# EAGLE schematic untitled (EAGLE 9.4.0)
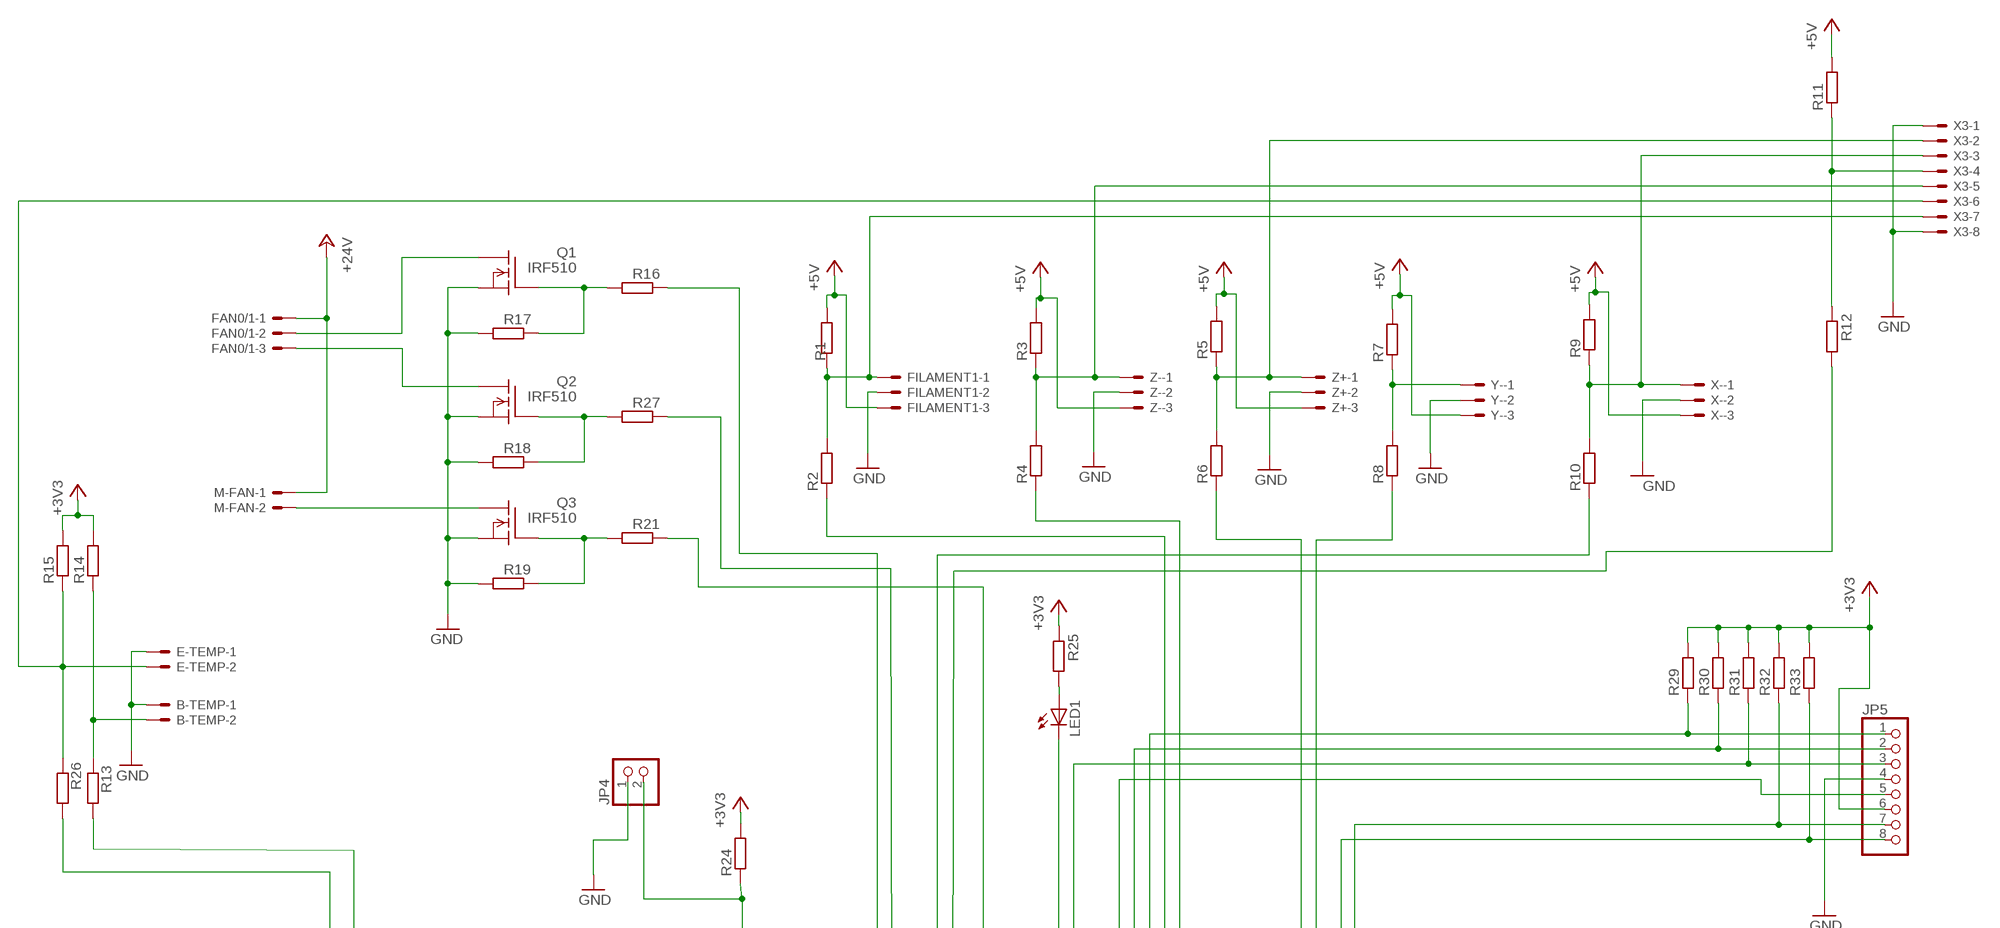
[diagram p0: schematic, sheet 1, part 1 of 3]
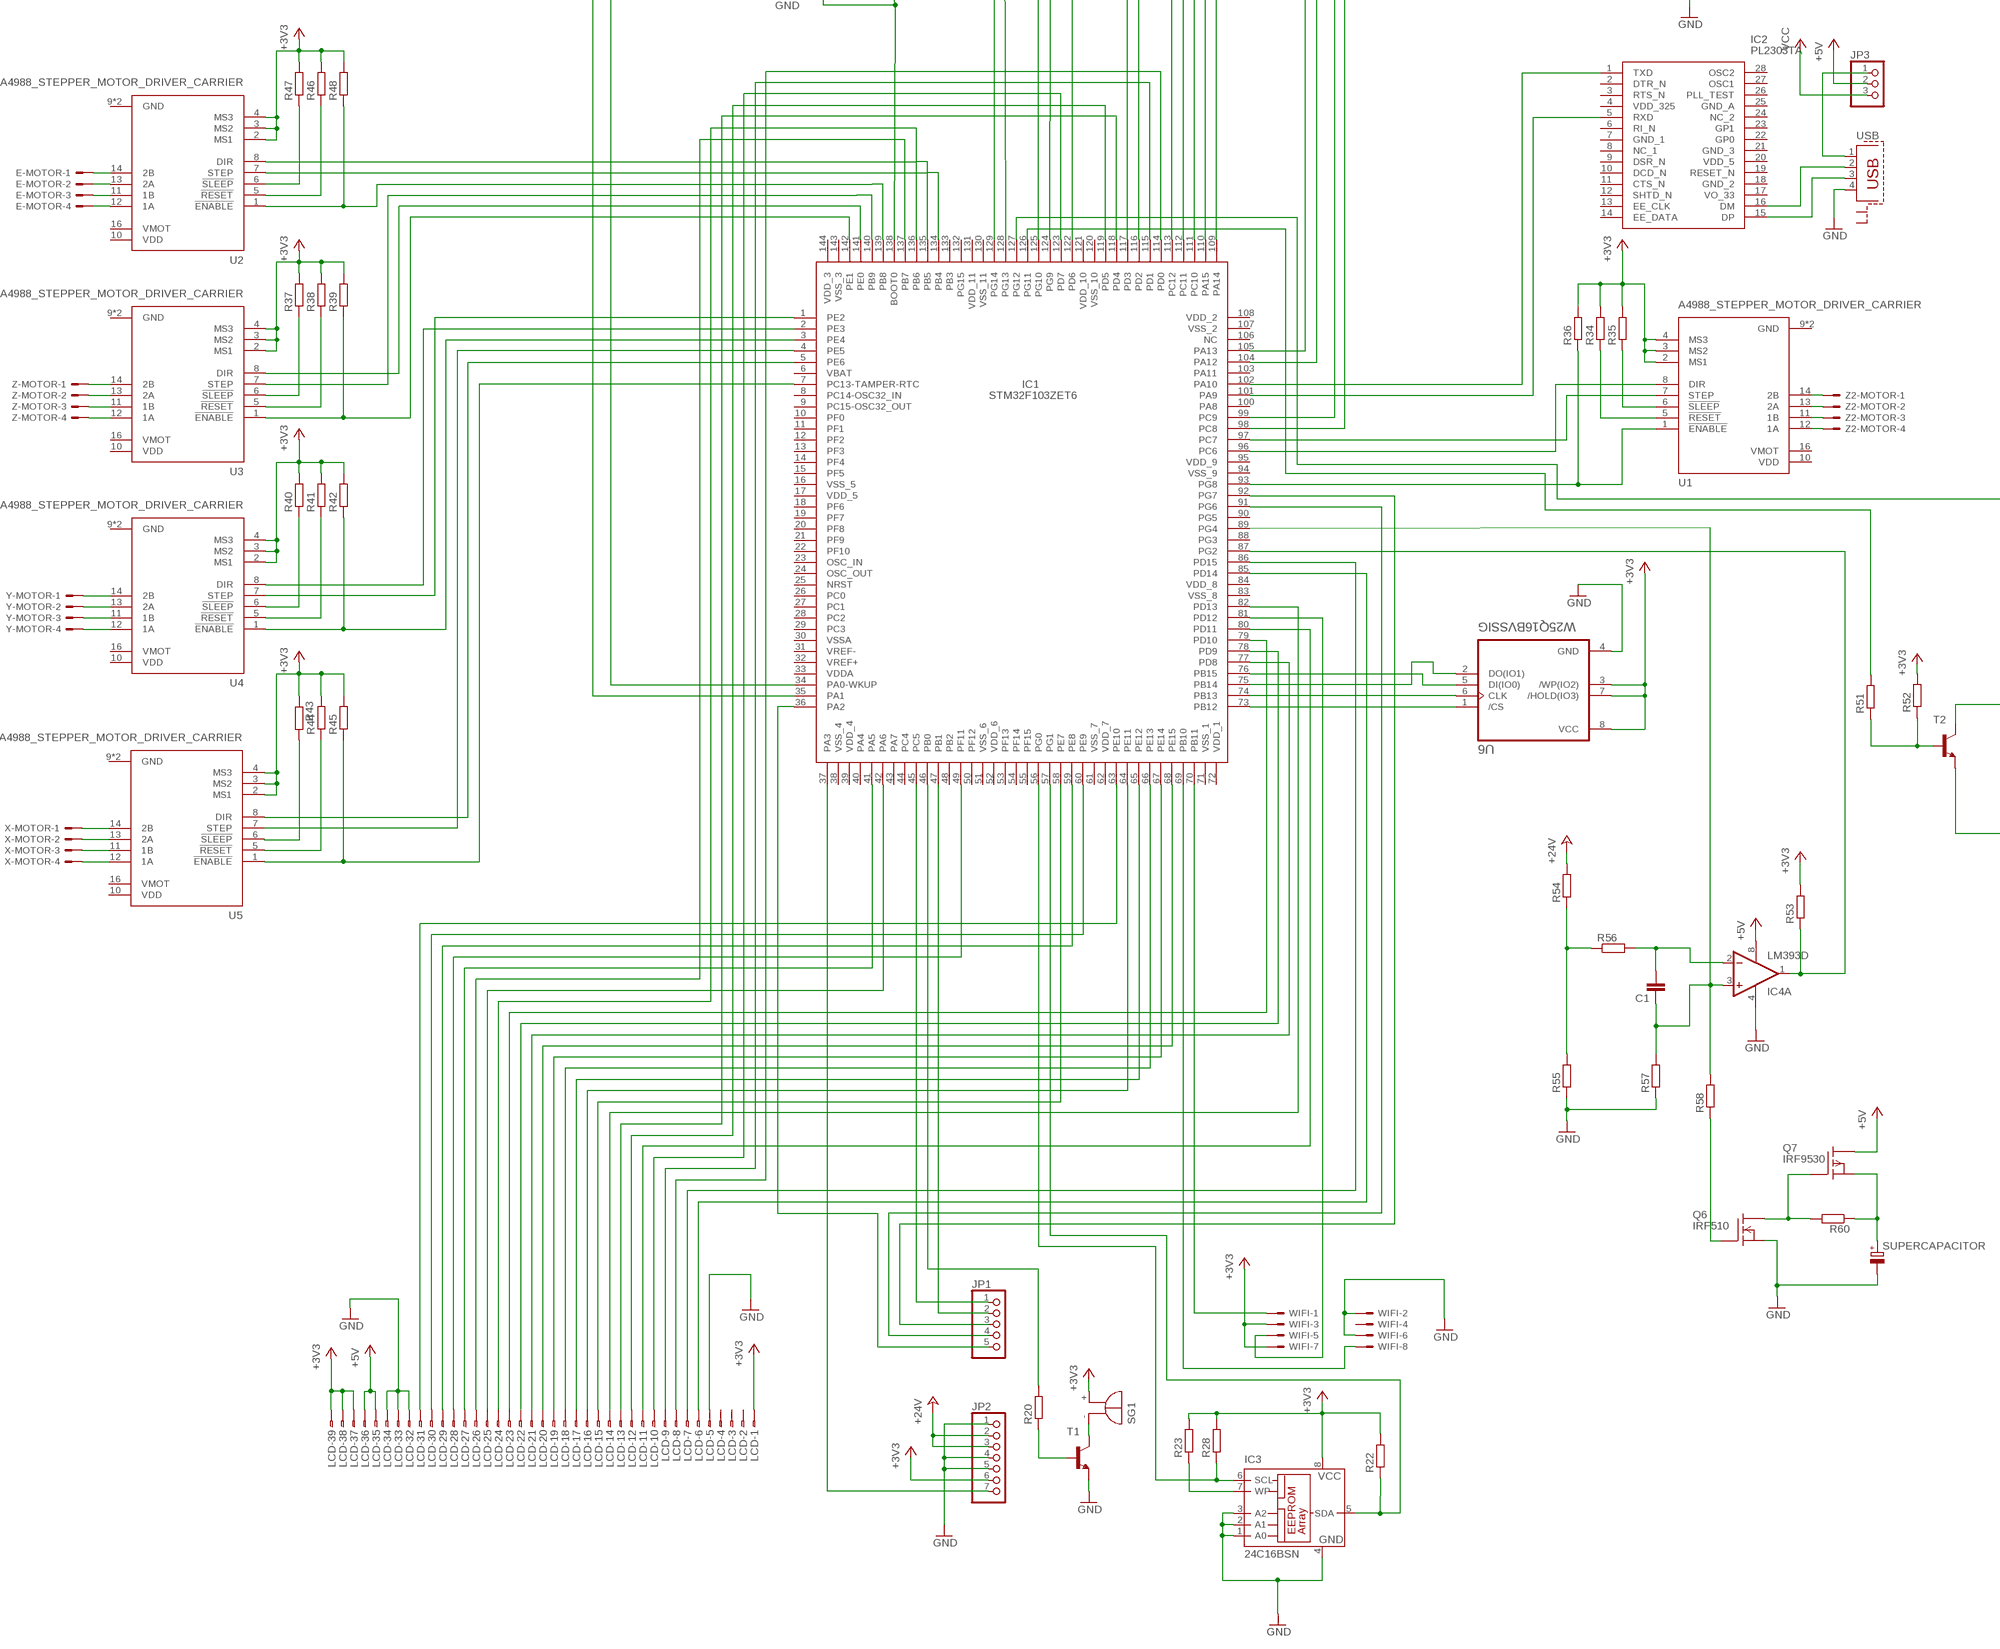
[diagram p1: schematic, sheet 1, part 2 of 3]
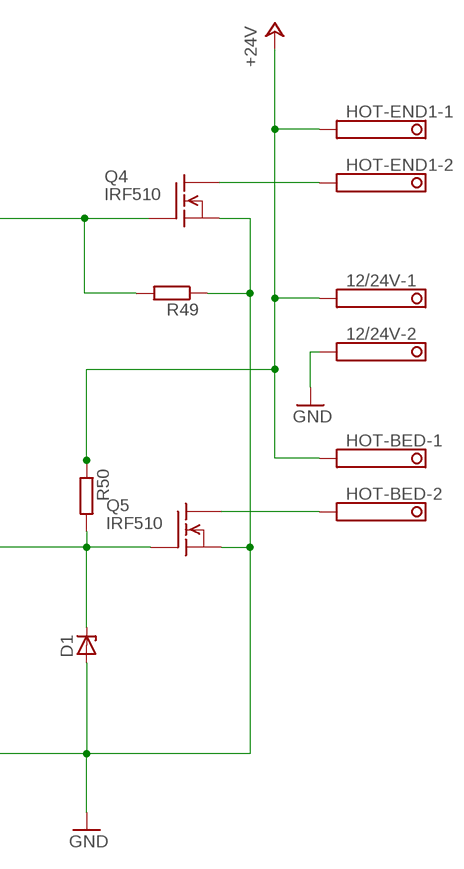
[diagram p2: schematic, sheet 1, part 3 of 3]

## Parts
12/24V  1751248  [1751248]
B-TEMP  C-GRID-02-70543  [70543-02]
C1  C-EUC0805  [C0805]
D1  ZENER-DIODESOD80C  [SOD80C]
E-MOTOR  C-GRID-04-70543  [70543-04]
E-TEMP  C-GRID-02-70543  [70543-02]
FAN0/1  C-GRID-03-70543  [70543-03]
FILAMENT1  C-GRID-03-70543  [70543-03]
HOT-BED  1751248  [1751248]
HOT-END1  1751248  [1751248]
IC1  STM32F103ZET6  [QFP50P2200X2200X160-144N]
IC2  PL2303TA  [SOP65P780X200-28N]
IC3  24C16BSN  [SO-08]
IC4  LM393D  [SO08]
JP1  PINHD-1X5  [1X05]
JP2  PINHD-1X7  [1X07]
JP3  PINHD-1X3  [1X03]
JP4  PINHD-1X2  [1X02]
JP5  PINHD-1X8  [1X08]
LCD  FH12-40S-0.5SH  [FH12-40S-0.5SH]
LED1  LED  [SMARTLED-TTW]
M-FAN  C-GRID-02-70543  [70543-02]
Q1  IRF510  [TO220]
Q2  IRF510  [TO220]
Q3  IRF510  [TO220]
Q4  IRF510  [TO220]
Q5  IRF510  [TO220]
Q6  IRF510  [TO220]
Q7  IRF9530  [TO220]
R1  R-EU_M0805  [M0805]
R2  R-EU_M0805  [M0805]
R3  R-EU_M0805  [M0805]
R4  R-EU_M0805  [M0805]
R5  R-EU_M0805  [M0805]
R6  R-EU_M0805  [M0805]
R7  R-EU_M0805  [M0805]
R8  R-EU_M0805  [M0805]
R9  R-EU_M0805  [M0805]
R10  R-EU_M0805  [M0805]
R11  R-EU_M0805  [M0805]
R12  R-EU_M0805  [M0805]
R13  R-EU_M0805  [M0805]
R14  R-EU_M0805  [M0805]
R15  R-EU_M0805  [M0805]
R16  R-EU_M0805  [M0805]
R17  R-EU_M0805  [M0805]
R18  R-EU_M0805  [M0805]
R19  R-EU_M0805  [M0805]
R20  R-EU_M0805  [M0805]
R21  R-EU_M0805  [M0805]
R22  R-EU_M0805  [M0805]
R23  R-EU_M0805  [M0805]
R24  R-EU_M0805  [M0805]
R25  R-EU_M0805  [M0805]
R26  R-EU_M0805  [M0805]
R27  R-EU_M0805  [M0805]
R28  R-EU_M0805  [M0805]
R29  R-EU_M0805  [M0805]
R30  R-EU_M0805  [M0805]
R31  R-EU_M0805  [M0805]
R32  R-EU_M0805  [M0805]
R33  R-EU_M0805  [M0805]
R34  R-EU_M0805  [M0805]
R35  R-EU_M0805  [M0805]
R36  R-EU_M0805  [M0805]
R37  R-EU_M0805  [M0805]
R38  R-EU_M0805  [M0805]
R39  R-EU_M0805  [M0805]
R40  R-EU_M0805  [M0805]
R41  R-EU_M0805  [M0805]
R42  R-EU_M0805  [M0805]
R43  R-EU_M0805  [M0805]
R44  R-EU_M0805  [M0805]
R45  R-EU_M0805  [M0805]
R46  R-EU_M0805  [M0805]
R47  R-EU_M0805  [M0805]
R48  R-EU_M0805  [M0805]
R49  R-EU_M0805  [M0805]
R50  R-EU_M0805  [M0805]
R51  R-EU_M0805  [M0805]
R52  R-EU_M0805  [M0805]
R53  R-EU_M0805  [M0805]
R54  R-EU_M0805  [M0805]
R55  R-EU_M0805  [M0805]
R56  R-EU_M0805  [M0805]
R57  R-EU_M0805  [M0805]
R58  R-EU_M0805  [M0805]
R60  R-EU_M0805  [M0805]
SG1  F/QMBIII  [F/QMBIII]
SUPERCAPACITOR  CPOL-EUE10-22.5  [EB22,5D]
T1  BC817-40-NPN-SOT23-BEC  [SOT23-BEC]
T2  BC817-40-NPN-SOT23-BEC  [SOT23-BEC]
U1  A4988_STEPPER_MOTOR_DRIVER_CARRIER  [MODULE_A4988_STEPPER_MOTOR_DRIVER_CARRIER]
U2  A4988_STEPPER_MOTOR_DRIVER_CARRIER  [MODULE_A4988_STEPPER_MOTOR_DRIVER_CARRIER]
U3  A4988_STEPPER_MOTOR_DRIVER_CARRIER  [MODULE_A4988_STEPPER_MOTOR_DRIVER_CARRIER]
U4  A4988_STEPPER_MOTOR_DRIVER_CARRIER  [MODULE_A4988_STEPPER_MOTOR_DRIVER_CARRIER]
U5  A4988_STEPPER_MOTOR_DRIVER_CARRIER  [MODULE_A4988_STEPPER_MOTOR_DRIVER_CARRIER]
U6  W25Q16BVSSIG  [SOIC127P790X216-8N]
USB  PN61729-S  [PN61729-S]
WIFI  87758-0816  [87758-0816]
X3  C-GRID-08-70543  [70543-08]
X-  C-GRID-03-70543  [70543-03]
X-MOTOR  C-GRID-04-70543  [70543-04]
Y-  C-GRID-03-70543  [70543-03]
Y-MOTOR  C-GRID-04-70543  [70543-04]
Z2-MOTOR  C-GRID-04-70543  [70543-04]
Z+  C-GRID-03-70543  [70543-03]
Z-  C-GRID-03-70543  [70543-03]
Z-MOTOR  C-GRID-04-70543  [70543-04]

## Nets
+3V3: IC3.8(VCC) JP2.6 JP5.6 LCD.1 LCD.37 LCD.38 LCD.39 R14.2 R15.2 R22.2 R23.2 R24.2 R25.1 R28.2 R29.2 R30.2 R31.2 R32.2 R33.2 R34.2 R35.2 R36.2 R37.2 R38.2 R39.2 R40.2 R41.2 R42.2 R43.1 R44.2 R45.2 R46.2 R47.2 R48.2 R52.2 R53.2 SG1.+(-) U1.2(MS1) U1.3(MS2) U1.4(MS3) U2.2(MS1) U2.3(MS2) U2.4(MS3) U3.2(MS1) U3.3(MS2) U3.4(MS3) U4.2(MS1) U4.3(MS2) U4.4(MS3) U5.2(MS1) U5.3(MS2) U5.4(MS3) U6.3(/WP(IO2)) U6.7(/HOLD(IO3)) U6.8(VCC) WIFI.3 WIFI.7
+5V: FILAMENT1.3 IC4.8(P:V+) JP3.2 LCD.35 LCD.36 Q7.2(D) R1.2 R3.2 R5.2 R7.2 R9.2 R11.2 X-.3 Y-.3 Z+.3 Z-.3
+24V: 12/24V.1 FAN0/1.1 HOT-BED.1 HOT-END1.1 JP2.2 JP2.3 M-FAN.1 R50.1 R54.2
.: IC1.57(PG1) IC3.5(SDA) R22.1
FILAMENT1: FILAMENT1.1 R1.1 R2.2 X3.7
GND: 12/24V.2 B-TEMP.1 D1.A E-TEMP.1 FILAMENT1.2 IC3.1(A0) IC3.2(A1) IC3.3(A2) IC3.4(GND) IC4.4(P:V-) JP2.1 JP2.4 JP2.5 JP4.1 JP5.4 LCD.5 LCD.32 LCD.33 LCD.34 Q1.3(S) Q2.3(S) Q3.3(S) Q4.3(S) Q5.3(S) Q6.3(S) R17.2 R18.2 R19.2 R49.1 R55.1 R57.1 SUPERCAPACITOR.- T1.E T2.E U6.4(GND) USB.4 WIFI.2 WIFI.6 X3.1 X3.8 X-.2 Y-.2 Z+.2 Z-.2
N$1: R11.1 R12.1 X3.4
N$2: R3.1 R4.2 X3.5 Z-.1
N$3: R9.1 R10.2 X3.3 X-.1
N$4: R5.1 R6.2 X3.2 Z+.1
N$5: IC1.76(PB15) U6.5(DI(IO0))
N$6: IC1.125(PG10) R10.1
N$7: IC1.104(PA12) R8.1
N$8: IC1.105(PA13) R6.1
N$9: IC1.109(PA14) R4.1
N$10: IC1.110(PA15) R2.1
N$11: IC1.124(PG9) R12.2
N$12: Q1.1(G) R16.2 R17.1
N$13: Q2.1(G) R18.1 R27.2
N$14: Q3.1(G) R19.1 R21.2
N$15: IC1.122(PD6) R21.1
N$16: FAN0/1.2 Q1.2(D)
N$17: FAN0/1.3 Q2.2(D)
N$18: M-FAN.2 Q3.2(D)
N$19: IC1.129(PG14) R16.1
N$20: IC1.128(PG13) R27.1
N$21: R43.2 U5.6(!SLEEP)
N$22: E-TEMP.2 R15.1 R26.2 X3.6
N$23: IC1.35(PA1) R26.1
N$24: IC1.34(PA0-WKUP) R13.1
N$25: IC1.70(PB11) WIFI.1
N$26: IC1.69(PB10) WIFI.8
N$27: IC1.45(PC5) JP1.1
N$28: IC1.81(PD12) WIFI.5
N$29: IC1.47(PB1) JP1.2
N$30: IC1.92(PG7) JP1.3
N$31: IC1.91(PG6) JP1.4
N$32: IC1.36(PA2) JP1.5
N$33: IC1.37(PA3) JP2.7
N$34: IC1.117(PD3) LED1.C@1(C)
N$35: LED1.A@1(A) R25.2
N$36: IC1.46(PB0) R20.2
N$37: R20.1 T1.B
N$38: SG1.-(+) T1.C
N$39: JP3.1 USB.1
N$40: IC2.16(DM) USB.2
N$41: IC2.15(DP) USB.3
N$42: IC1.102(PA10) IC2.1(TXD)
N$43: IC1.101(PA9) IC2.5(RXD)
N$44: IC1.56(PG0) IC3.6(SCL) R28.1
N$46: IC1.138(BOOT0) JP4.2 R24.1
N$47: IC1.111(PC10) JP5.1 R29.1
N$48: IC1.112(PC11) JP5.2 R30.1
N$49: IC1.116(PD2) JP5.3 R31.1
N$50: IC1.113(PC12) JP5.5
N$51: IC1.98(PC8) JP5.7 R32.1
N$52: IC1.99(PC9) JP5.8 R33.1
N$53: IC1.96(PC6) U1.8(DIR)
N$54: IC1.97(PC7) U1.7(STEP)
N$55: IC1.93(PG8) R36.1 U1.1(!ENABLE)
N$56: U1.14(2B) Z2-MOTOR.1
N$57: U1.13(2A) Z2-MOTOR.2
N$58: U1.11(1B) Z2-MOTOR.3
N$59: U1.12(1A) Z2-MOTOR.4
N$60: R34.1 U1.5(!RESET)
N$61: R35.1 U1.6(!SLEEP)
N$62: IC1.139(PB8) R48.1 U2.1(!ENABLE)
N$63: IC1.134(PB4) U2.7(STEP)
N$64: IC1.135(PB5) U2.8(DIR)
N$65: E-MOTOR.1 U2.14(2B)
N$66: R47.1 U2.6(!SLEEP)
N$67: R46.1 U2.5(!RESET)
N$68: E-MOTOR.2 U2.13(2A)
N$69: E-MOTOR.3 U2.11(1B)
N$70: E-MOTOR.4 U2.12(1A)
N$71: IC1.141(PE0) U3.8(DIR)
N$72: IC1.140(PB9) U3.7(STEP)
N$73: R37.1 U3.6(!SLEEP)
N$74: R38.1 U3.5(!RESET)
N$75: IC1.142(PE1) R39.1 U3.1(!ENABLE)
N$76: U3.14(2B) Z-MOTOR.1
N$77: U3.13(2A) Z-MOTOR.2
N$78: U3.11(1B) Z-MOTOR.3
N$79: U3.12(1A) Z-MOTOR.4
N$80: IC1.1(PE2) U4.7(STEP)
N$81: IC1.2(PE3) U4.8(DIR)
N$82: IC1.3(PE4) R42.1 U4.1(!ENABLE)
N$83: R40.1 U4.6(!SLEEP)
N$84: R41.1 U4.5(!RESET)
N$85: U4.14(2B) Y-MOTOR.1
N$86: U4.13(2A) Y-MOTOR.2
N$87: U4.11(1B) Y-MOTOR.3
N$88: U4.12(1A) Y-MOTOR.4
N$89: B-TEMP.2 R13.2 R14.1
N$90: R44.1 U5.5(!RESET)
N$91: IC1.7(PC13-TAMPER-RTC) R45.1 U5.1(!ENABLE)
N$92: IC1.4(PE5) U5.7(STEP)
N$93: IC1.5(PE6) U5.8(DIR)
N$94: U5.14(2B) X-MOTOR.1
N$95: U5.13(2A) X-MOTOR.2
N$96: U5.11(1B) X-MOTOR.3
N$97: U5.12(1A) X-MOTOR.4
N$98: R7.1 R8.2 Y-.1
N$99: IC1.74(PB13) U6.6(CLK)
N$100: IC1.73(PB12) U6.1(/CS)
N$101: IC1.75(PB14) U6.2(DO(IO1))
N$102: HOT-BED.2 Q5.2(D)
N$103: HOT-END1.2 Q4.2(D)
N$104: D1.C Q5.1(G) R50.2 T2.C
N$105: IC1.127(PG12) Q4.1(G) R49.2
N$106: R51.1 R52.1 T2.B
N$107: IC1.126(PG11) R51.2
N$108: IC1.87(PG2) IC4.1(A:OUT) R53.1
N$109: C1.2 IC4.2(A:-IN) R56.2
N$110: R54.1 R55.2 R56.1
N$111: Q6.1(G) R58.1
N$112: C1.1 IC1.89(PG4) IC4.3(A:+IN) R57.2 R58.2
N$113: Q6.2(D) Q7.1(G) R60.2
N$114: Q7.3(S) R60.1 SUPERCAPACITOR.+
N$115: IC1.86(PD15) LCD.7
N$116: IC1.85(PD14) LCD.6
N$117: IC1.114(PD0) LCD.8
N$118: IC1.123(PD7) LCD.10
N$119: IC1.115(PD1) LCD.9
N$120: IC1.80(PD11) LCD.11
N$121: IC1.119(PD5) LCD.12
N$122: IC1.118(PD4) LCD.13
N$123: IC1.82(PD13) LCD.14
N$124: IC1.58(PE7) LCD.15
N$125: IC1.64(PE11) LCD.16
N$126: IC1.65(PE12) LCD.17
N$127: IC1.66(PE13) LCD.18
N$128: IC1.67(PE14) LCD.19
N$129: IC1.68(PE15) LCD.20
N$130: IC1.77(PD8) LCD.21
N$131: IC1.78(PD9) LCD.22
N$132: IC1.79(PD10) LCD.23
N$133: IC1.136(PB6) LCD.24
N$134: IC1.42(PA6) LCD.25
N$135: IC1.137(PB7) LCD.26
N$136: IC1.41(PA5) LCD.27
N$137: IC1.63(PE10) LCD.31
N$138: IC1.60(PE9) LCD.30
N$139: IC1.59(PE8) LCD.29
N$140: IC1.49(PF11) LCD.28
N$141: IC3.7(WP) R23.1
VCC: JP3.3
Unconnected: IC1.6(VBAT) IC1.8(PC14-OSC32_IN) IC1.9(PC15-OSC32_OUT) IC1.10(PF0) IC1.11(PF1) IC1.12(PF2) IC1.13(PF3) IC1.14(PF4) IC1.15(PF5) IC1.18(PF6) IC1.19(PF7) IC1.20(PF8) IC1.21(PF9) IC1.22(PF10) IC1.23(OSC_IN) IC1.24(OSC_OUT) IC1.25(NRST) IC1.26(PC0) IC1.27(PC1) IC1.28(PC2) IC1.29(PC3) IC1.31(VREF-) IC1.32(VREF+) IC1.40(PA4) IC1.43(PA7) IC1.44(PC4) IC1.48(PB2) IC1.50(PF12) IC1.53(PF13) IC1.54(PF14) IC1.55(PF15) IC1.88(PG3) IC1.90(PG5) IC1.100(PA8) IC1.103(PA11) IC1.106(NC) IC1.132(PG15) IC1.133(PB3) IC2.2(DTR_N) IC2.3(RTS_N) IC2.4(VDD_325) IC2.6(RI_N) IC2.7(GND_1) IC2.8(NC_1) IC2.9(DSR_N) IC2.10(DCD_N) IC2.11(CTS_N) IC2.12(SHTD_N) IC2.13(EE_CLK) IC2.14(EE_DATA) IC2.17(VO_33) IC2.18(GND_2) IC2.19(RESET_N) IC2.20(VDD_5) IC2.21(GND_3) IC2.22(GP0) IC2.23(GP1) IC2.24(NC_2) IC2.25(GND_A) IC2.26(PLL_TEST) IC2.27(OSC1) IC2.28(OSC2) IC4.5(B:+IN) IC4.6(B:-IN) IC4.7(B:OUT) LCD.2 LCD.3 LCD.4 LCD.40 USB.S1 USB.S2 WIFI.4

## Power pins joined to a net without a drawn wire
GND: U1.9(GND) U1.15(GND) U2.9(GND) U2.15(GND) U3.9(GND) U3.15(GND) U4.9(GND) U4.15(GND) U5.9(GND) U5.15(GND)
VDD: U1.10(VDD) U2.10(VDD) U3.10(VDD) U4.10(VDD) U5.10(VDD)
VDD_1: IC1.72(VDD_1)
VDD_2: IC1.108(VDD_2)
VDD_3: IC1.144(VDD_3)
VDD_4: IC1.39(VDD_4)
VDD_5: IC1.17(VDD_5)
VDD_6: IC1.52(VDD_6)
VDD_7: IC1.62(VDD_7)
VDD_8: IC1.84(VDD_8)
VDD_9: IC1.95(VDD_9)
VDD_10: IC1.121(VDD_10)
VDD_11: IC1.131(VDD_11)
VDDA: IC1.33(VDDA)
VMOT: U1.16(VMOT) U2.16(VMOT) U3.16(VMOT) U4.16(VMOT) U5.16(VMOT)
VSS_1: IC1.71(VSS_1)
VSS_2: IC1.107(VSS_2)
VSS_3: IC1.143(VSS_3)
VSS_4: IC1.38(VSS_4)
VSS_5: IC1.16(VSS_5)
VSS_6: IC1.51(VSS_6)
VSS_7: IC1.61(VSS_7)
VSS_8: IC1.83(VSS_8)
VSS_9: IC1.94(VSS_9)
VSS_10: IC1.120(VSS_10)
VSS_11: IC1.130(VSS_11)
VSSA: IC1.30(VSSA)

## Library data of the parts
12/24V HOT-BED HOT-END1 = con-phoenix-350:1751248: MKDS 1/ 2-3,5 Printklemme Nennstrom: 10 A Bemessungsspannung: 160 V Raster: 3,5 mm Polzahl: 2 Montageart: Löten Anschlussart: Schraubanschluss Anschlussrichtung vom Leiter zur Platine: 0° Source: http://eshop.phoenixcontact.com .. 1751248.pdf; OC_FARNELL: unknown; OC_NEWARK: unknown
B-TEMP E-TEMP M-FAN = con-molex:C-GRID-02: CONNECTOR wire to board 2.54 mm (0.100") pitch header; MF: MOLEX; OC_FARNELL: unknown; OC_NEWARK: unknown
C1 = rcl:C-EU: CAPACITOR, European symbol; SPICEPREFIX: C
D1 = diode:ZENER-DIODE: Z-Diode
E-MOTOR X-MOTOR Y-MOTOR Z2-MOTOR Z-MOTOR = con-molex:C-GRID-04: CONNECTOR wire to board 2.54 mm (0.100") pitch header; MF: MOLEX; OC_FARNELL: unknown; OC_NEWARK: unknown
FAN0/1 FILAMENT1 X- Y- Z+ Z- = con-molex:C-GRID-03: CONNECTOR wire to board 2.54 mm (0.100") pitch header; MF: MOLEX; OC_FARNELL: unknown; OC_NEWARK: unknown
IC1 = stm32f103zet6:STM32F103ZET6: STM32F103ZET6, 32 bit ARM Cortex M3 Microcontroller 72MHz 512kb Flash, 64kb RAM, USB I2C SPI 144-Pin LQFP Source: Datasheet <http://www.st.com/st-web-ui/static/active/en/resource/technical/document/datasheet/CD00191185.pdf>; ALLIED_NUMBER: 70391039; ALLIED_PRICE-STOCK: http://www.alliedelec.com/stmicroelectronics-stm32f103zet6/70391039/; DESCRIPTION: STM32F103ZET6, 32 bit ARM Cortex M3 Microcontroller 72MHz 512kb Flash, 64kb RAM, USB I2C SPI 144-Pin LQFP; HEIGHT: 1.6mm; MANUFACTURER_NAME: STMicroelectronics; MANUFACTURER_PART_NUMBER: STM32F103ZET6; MOUSER_PART_NUMBER: 511-STM32F103ZET6; MOUSER_PRICE-STOCK: https://www.mouser.com/Search/Refine.aspx?Keyword=511-STM32F103ZET6; RS_PART_NUMBER: 6868596P; RS_PRICE-STOCK: http://china.rs-online.com/web/p/products/6868596P
IC2 = PL2303TA:PL2303TA: USB to Serial Bridge Controller Source: Datasheet <https://cdn-shop.adafruit.com/datasheets/DS_PL2303TA_d20120504.pdf>; DESCRIPTION: USB to Serial Bridge Controller; HEIGHT: 2mm; MANUFACTURER_NAME: Prolific; MANUFACTURER_PART_NUMBER: PL2303TA
IC3 = microchip:24*: Serial EEPROM I2C; MPN: AT24C16BN-SH-B; OC_FARNELL: 1362651; OC_NEWARK: 50M3324
IC4 = linear:LM393: COMPARATOR; SPICEPREFIX: J
JP1 = pinhead:PINHD-1X5: PIN HEADER
JP2 = pinhead:PINHD-1X7: PIN HEADER
JP3 = pinhead:PINHD-1X3: PIN HEADER
JP4 = pinhead:PINHD-1X2: PIN HEADER
JP5 = pinhead:PINHD-1X8: PIN HEADER
LCD = con-hirose:FH12-40S-0.5S: 0.5mm Pitch Connectors For FPC/FFC Source: Data sheet <http://www.hirose.co.jp/cataloge_hp/e58605370.pdf>; MPN: FH12-40S-0.5SH(55); OC_FARNELL: 1324556; OC_NEWARK: 34M6178
LED1 = led:LED: LED OSRAM: - CHIPLED LG R971, LG N971, LY N971, LG Q971, LY Q971, LO R971, LY R971 LH N974, LH R974 LS Q976, LO Q976, LY Q976 LO Q996 - Hyper CHIPLED LW Q18S LB Q993, LB Q99A, LB R99A - SideLED LS A670, LO A670, LY A670, LG A670, LP A670 LB A673, LV A673, LT A673, LW A673 LH A674 LY A675 LS A676, LA A676, LO A676, LY A676, LW A676 LS A679, LY A679, LG A679 - Hyper Micro SIDELED® LS Y876, LA Y876, LO Y876, LY Y876 LT Y87S - SmartLED LW L88C, LW L88S LB L89C, LB L89S, LG L890 LS L89K, LO L89K, LY L89K LS L896, LA L896, LO L896, LY L896 - TOPLED LS T670, LO T670, LY T670, LG T670, LP T670 LSG T670, LSP T670, LSY T670, LOP T670, LYG T670 LG T671, LOG T671, LSG T671 LB T673, LV T673, LT T673, LW T673 LH T674 LS T676, LA T676, LO T676, LY T676, LB T676, LH T676, LSB T676, LW T676 LB T67C, LV T67C, LT T67C, LS T67K, LO T67K, LY T67K, LW E67C LS E67B, LA E67B, LO E67B, LY E67B, LB E67C, LV E67C, LT E67C LW T67C LS T679, LY T679, LG T679 LS T770, LO T770, LY T770, LG T770, LP T770 LB T773, LV T773, LT T773, LW T773 LH T774 LS E675, LA E675, LY E675, LS T675 LS T776, LA T776, LO T776, LY T776, LB T776 LHGB T686 LT T68C, LB T68C - Hyper Mini TOPLED® LB M676 - Mini TOPLED Santana® LG M470 LS M47K, LO M47K, LY M47K Source: http://www.osram.convergy.de LUXEON: - LUMILED® LXK2-PW12-R00, LXK2-PW12-S00, LXK2-PW14-U00, LXK2-PW14-V00 LXK2-PM12-R00, LXK2-PM12-S00, LXK2-PM14-U00 LXK2-PE12-Q00, LXK2-PE12-R00, LXK2-PE12-S00, LXK2-PE14-T00, LXK2-PE14-U00 LXK2-PB12-K00, LXK2-PB12-L00, LXK2-PB12-M00, LXK2-PB14-N00, LXK2-PB14-P00, LXK2-PB14-Q00 LXK2-PR12-L00, LXK2-PR12-M00, LXK2-PR14-Q00, LXK2-PR14-R00 LXK2-PD12-Q00, LXK2-PD12-R00, LXK2-PD12-S00 LXK2-PH12-R00, LXK2-PH12-S00 LXK2-PL12-P00, LXK2-PL12-Q00, LXK2-PL12-R00 Source: www.luxeon.com KINGBRIGHT: KA-3528ASYC Source: www.kingbright.com
Q1-Q6 = transistor-fet:IRF510: N-Channel Enhancement MOSFET (HEXFET); 100V; 5,6A; 0,54Ohm
Q7 = transistor-fet:IRF9530: P-Channel Enhancement MOSFET (HEXFET); -100V; -12A; 0,3Ohm
R1-R58 R60 = rcl:R-EU_: RESISTOR, European symbol; SPICEPREFIX: R
SG1 = buzzer:F/QMBIII: BUZZER Source: Buerklin; OC_FARNELL: unknown; OC_NEWARK: unknown
SUPERCAPACITOR = rcl:CPOL-EU: POLARIZED CAPACITOR, European symbol; SPICEPREFIX: C
T1 T2 = transistor:*-NPN-: NPN Transistror BF959 corrected 2008.03.06
U1-U5 = A4988_STEPPER_MOTOR_DRIVER_CARRIER:A4988_STEPPER_MOTOR_DRIVER_CARRIER: Stepper motor controler; IC: A4988; 1A; Uin mot: 8÷35V; AVAILABILITY: Unavailable; DESCRIPTION: Stepper Motor Driver; MF: Pololu; MP: A4988 STEPPER MOTOR DRIVER CARRIER; PACKAGE: None; PRICE: None
U6 = W25Q16BVSSIG:W25Q16BVSSIG: Flash, pin, soic, flash, Memory, Semiconductors and Actives, serial, ic; AVAILABILITY: Unavailable; DESCRIPTION: FLASH - NOR Memory IC 16Mb _2M x 8_ SPI - Quad I/O 104MHz 8-SOIC; MF: Winbond; MP: W25Q16BVSSIG; PACKAGE: SOIC-8 Winbond; PRICE: None
USB = con-berg:PN61729-S: BERG USB connector; OC_FARNELL: unknown; OC_NEWARK: unknown
WIFI = con-molex:87758-0816: 8 Pin - 2mm Dual Row Single Wafer, Vertical T/H HDR Source: http://www.molex.com/pdm_docs/sd/877580616_sd.pdf; MF: MOLEX; MPN: 87758-0816; OC_FARNELL: 7472331; OC_NEWARK: 59J1556
X3 = con-molex:C-GRID-08: CONNECTOR wire to board 2.54 mm (0.100") pitch header; MF: MOLEX; OC_FARNELL: unknown; OC_NEWARK: unknown